# Altium schematic sheet Sitara_Sheet2.SchDoc
size A4; CompanyName: SPAN; Engineer: Anh Luong; Organization: University of Utah; Address1: 50 S Central Campus Dr; Address2: MEB Rm 3129; Address3: Salt Lake City, Utah 84115; Address4: USA; Revision: 1; SheetNumber: 1; SheetTotal: 1
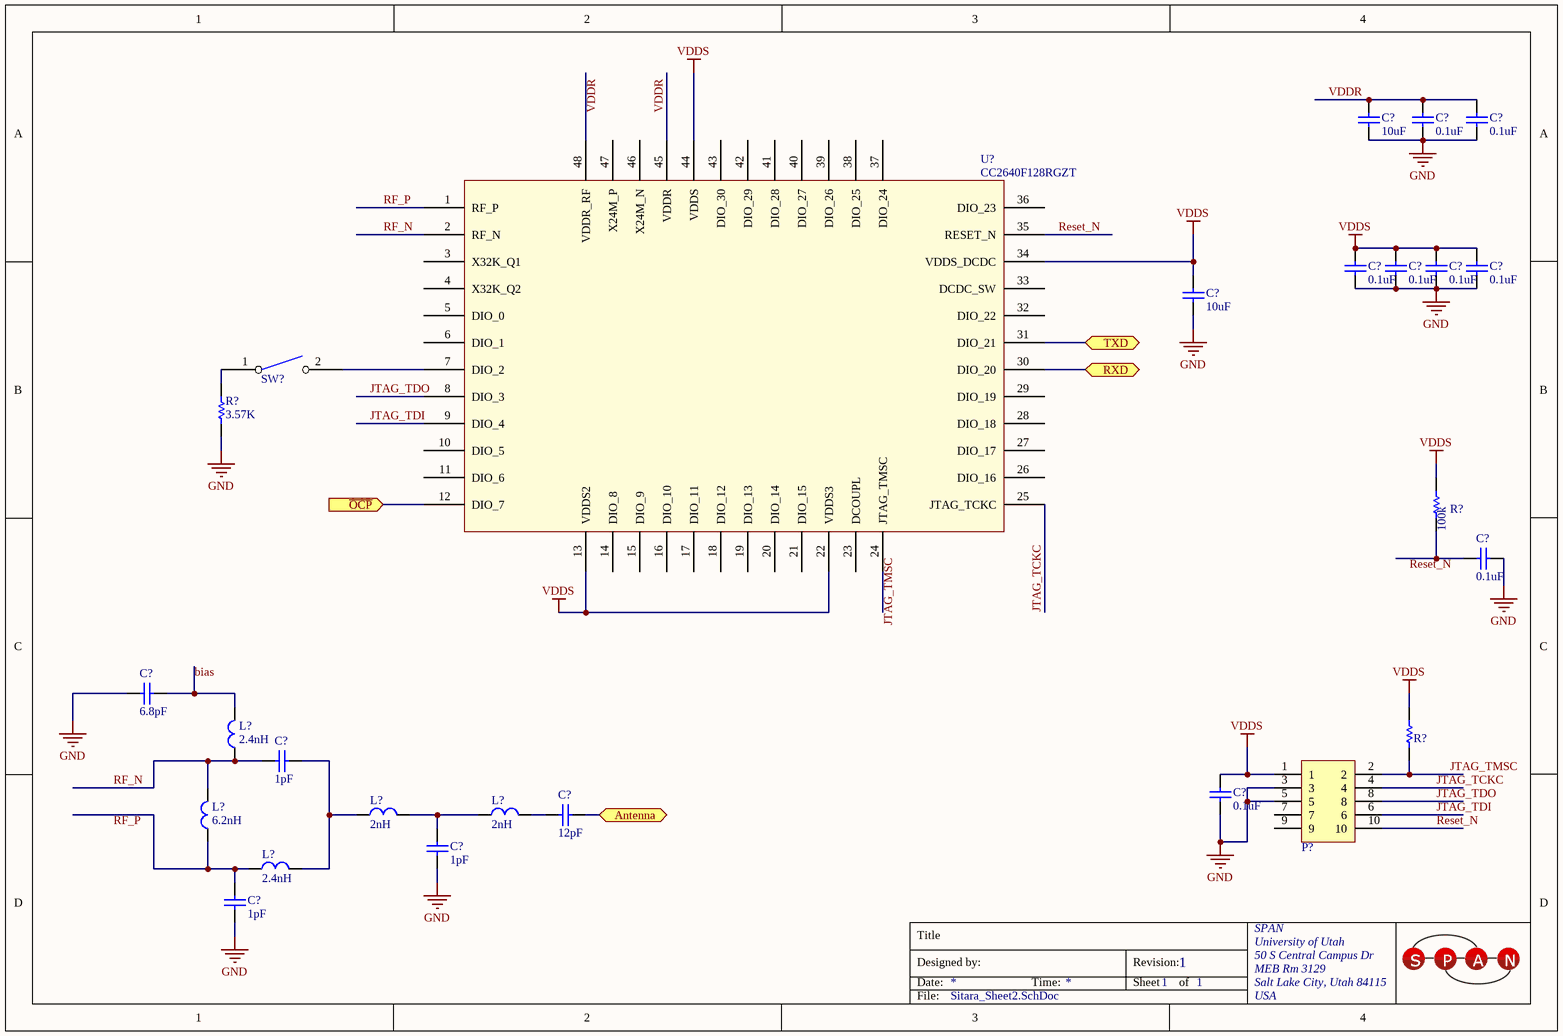
[diagram p0: Sitara_Sheet2.SchDoc]

## Parts
(Parts that share a designator on the sheet are numbered #1, #2 ... from top to bottom, then left to right.)
C?#1  10uF
C?#2  0.1uF
C?#3  0.1uF
C?#4  0.1uF
C?#5  0.1uF
C?#6  0.1uF
C?#7  0.1uF
C?#8  10uF
C?#9  0.1uF
C?#10  6.8pF
C?#11  1pF
C?#12  12pF
C?#13  0.1uF
C?#14  1pF
C?#15  1pF
L?#1  2.4nH
L?#2  2nH
L?#3  2nH
L?#4  6.2nH
L?#5  2.4nH
P?  M50-3500542  [M50]  (value not drawn)
R?#1  3.57K
R?#2  MCR03ERTJ104  [RESC1608X06N (0603)]  (value not drawn)
R?#3  10K  (value not drawn)
SW?  EVQ-PE105K  [EVQ-PE105K]  (value not drawn)
U?  CC2640F128RGZT

## Ports
Antenna (bidir), RXD, TXD, ~{OCP} (in)

## Nets
GND: C?#1.10 C?#2.8 C?#3.8 C?#4.8 C?#5.8 C?#6.8 C?#7.8 C?#8.10 C?#9.9 C?#10.0 C?#13.8 C?#14.2 C?#15.2 P?.3 P?.5 R?#1.16
VDDS: C?#4.9 C?#5.9 C?#6.9 C?#7.9 C?#8.11 C?#13.9 P?.1 R?#2.2 R?#3.1 U?.13(VDDS2) U?.22(VDDS3) U?.34(VDDS_DCDC) U?.44(VDDS)
Antenna: C?#12.5 ; port Antenna
bias: C?#10.1 L?#1.7
JTAG_TCKC: P?.4 U?.25(JTAG_TCKC)
JTAG_TDI: P?.6 U?.9(DIO_4)
JTAG_TDO: P?.8 U?.8(DIO_3)
JTAG_TMSC: P?.2 R?#3.0
~{OCP}: U?.12(DIO_7) ; port ~{OCP}
Reset_N: P?.10 U?.35(RESET_N)
RF_N: C?#11.2 L?#1.6 L?#4.11 U?.2(RF_N)
RF_P: U?.1(RF_P)
RXD: U?.30(DIO_20) ; port RXD
TXD: U?.31(DIO_21) ; port TXD
VDDR: C?#1.11 C?#2.9 C?#3.9 U?.45(VDDR)
NetC?#9_8: C?#9.8 R?#2.1
NetC?#11_3: C?#11.3 L?#2.8 L?#5.7
NetC?#12_4: C?#12.4 L?#3.9
NetC?#14_3: C?#14.3 L?#2.9 L?#3.8
NetC?#15_3: C?#15.3 L?#4.10 L?#5.6
NetR?#1_17: R?#1.17 SW?.1
NetSW?_2: SW?.2 U?.7(DIO_2)

Not connected (* = marked no-connect by the designer): P? 7 9; U? 3(X32K_Q1) 4(X32K_Q2) 5(DIO_0) 6(DIO_1) 10(DIO_5) 11(DIO_6) 14(DIO_8) 15(DIO_9) 16(DIO_10) 17(DIO_11) 18(DIO_12) 19(DIO_13) 20(DIO_14) 21(DIO_15) 23(DCOUPL) 24(JTAG_TMSC) 26(DIO_16) 27(DIO_17) 28(DIO_18) 29(DIO_19) 32(DIO_22) 33(DCDC_SW) 36(DIO_23) 37(DIO_24) 38(DIO_25) 39(DIO_26) 40(DIO_27) 41(DIO_28) 42(DIO_29) 43(DIO_30) 46(X24M_N) 47(X24M_P) 48(VDDR_RF)

## Notes on the sheet
- Labels drawn without touching a wire or pin: JTAG_TMSC, Reset_N, RF_P, VDDR
- Title
- Designed by:
- Date:
- Time:
- Revision:
- Sheet
- of
- File:

## Library data of the parts
C?#1 C?#8 = EMK107BC6106MA-T: CAP CER 10uF; Manufacturer: Taiyo Yuden; Capacitance: 10µF; Tolerance: ±20%; Voltage - Rated: 16V; Temperature Coefficient: X6S; Supplier 1: Digi-Key; Manufacturer Part Number: EMK107BC6106MA-T; RoHS: RoHS Compliant; Category: Capacitors; Stock 1: 0; Pricing 1: 4000=0.08689, 8000=0.08178, 12000=0.07922, 28000=0.07667, 100000=0.06798 (USD); Packaging: Tape & Reel (TR); Part Status: Active; Operating Temperature: -55°C ~ 105°C; Features: -; Ratings: -; Applications: SMPS Filtering; Failure Rate: -; Mounting Type: Surface Mount, MLCC; Package / Case: 0603 (1608 Metric); Size / Dimension: 0.063" L x 0.031" W (1.60mm x 0.80mm); Height - Seated (Max): -; Thickness (Max): 0.039" (1.00mm); Lead Spacing: -; Lead Style: -; ComponentLink1URL: http://www.yuden.co.jp/productdata/catalog/en/mlcc06_e.pdf; ComponentLink1Description: http://www.yuden.co.jp/productdata/catalog/en/mlcc06_e.pdf; Supplier Part Number 1: 587-4867-2-ND
C?#2-C?#7 C?#9 C?#13 = 0603YC104KAT4A: CAP CER 0.1UF 16V X7R 0603; Manufacturer: AVX Corporation; Capacitance: 0.1µF; Tolerance: ±10%; Supplier 1: Digi-Key; Manufacturer Part Number: 0603YC104KAT4A; RoHS: RoHS Compliant; Category: Capacitors; Stock 1: 15000; Pricing 1: 15000=0.00344, 30000=0.00327, 75000=0.00292, 105000=0.00237 (USD); Packaging: Tape & Reel (TR); Part Status: Active; Voltage - Rated: 16V; Temperature Coefficient: X7R; Operating Temperature: -55°C ~ 125°C; Features: -; Ratings: -; Applications: General Purpose; Failure Rate: -; Mounting Type: Surface Mount, MLCC; Package / Case: 0603 (1608 Metric); Size / Dimension: 0.063" L x 0.032" W (1.60mm x 0.81mm); Height - Seated (Max): -; Thickness (Max): 0.035" (0.90mm); Lead Spacing: -; Lead Style: -; ComponentLink1URL: http://datasheets.avx.com/X7RDielectric.pdf; ComponentLink1Description: http://datasheets.avx.com/X7RDielectric.pdf; Supplier Part Number 1: 478-10054-2-ND
C?#10 = CL10C6R8CB8NNNC: CAP CER 6.8PF 50V NP0 0603; Manufacturer: Samsung Electro-Mechanics America, Inc.; Tolerance: ±0.25pF; Temperature Coefficient: C0G, NP0; Supplier 1: Digi-Key; Manufacturer Part Number: CL10C6R8CB8NNNC; RoHS: RoHS Compliant; Category: Capacitors; Stock 1: 16000; Pricing 1: 4000=0.00876, 8000=0.008, 12000=0.00762, 28000=0.00724, 100000=0.00524 (USD); Packaging: Tape & Reel (TR); Part Status: Active; Capacitance: 6.8pF; Voltage - Rated: 50V; Operating Temperature: -55°C ~ 125°C; Features: -; Ratings: -; Applications: General Purpose; Mounting Type: Surface Mount, MLCC; Package / Case: 0603 (1608 Metric); Size / Dimension: 0.063" L x 0.031" W (1.60mm x 0.80mm); Height - Seated (Max): -; Thickness (Max): 0.035" (0.90mm); Lead Spacing: -; Lead Style: -; ComponentLink1URL: http://www.samsungsem.com/kr/support/product-search/mlcc/__icsFiles/afieldfile/2016/08/18/S_CL10C6R8CB8NNNC.pdf; ComponentLink1Description: http://www.samsungsem.com/kr/support/product-search/mlcc/__icsFiles/afieldfile/2016/08/18/S_CL10C6R8CB8NNNC.pdf; Supplier Part Number 1: 1276-1793-2-ND
C?#11 C?#14 C?#15 = 251R14S1R0BV4T: CAP CER 1PF 250V NP0 0603; Manufacturer: Johanson Technology Inc.; Tolerance: ±0.1pF; Temperature Coefficient: C0G, NP0; Supplier 1: Digi-Key; Manufacturer Part Number: 251R14S1R0BV4T; RoHS: RoHS Compliant; Category: Capacitors; Stock 1: 92000; Pricing 1: 4000=0.048, 8000=0.0456, 12000=0.0432, 28000=0.0408, 100000=0.0324 (USD); Packaging: Tape & Reel (TR); Part Status: Active; Capacitance: 1pF; Voltage - Rated: 250V; Operating Temperature: -55°C ~ 125°C; Features: High Q, Low Loss; Ratings: -; Applications: RF, Microwave, High Frequency; Mounting Type: Surface Mount, MLCC; Package / Case: 0603 (1608 Metric); Size / Dimension: 0.062" L x 0.032" W (1.57mm x 0.81mm); Height - Seated (Max): -; Thickness (Max): 0.035" (0.89mm); Lead Spacing: -; Lead Style: -; ComponentLink1URL: http://www.johansontechnology.com/downloads/JTI-CAT-MLCC-HighQ.pdf; ComponentLink1Description: http://www.johansontechnology.com/downloads/JTI-CAT-MLCC-HighQ.pdf; Supplier Part Number 1: 712-1323-2-ND
C?#12 = 251R14S120GV4T: CAP CER 12PF 250V NP0 0603; Manufacturer: Johanson Technology Inc.; Tolerance: ±2%; Temperature Coefficient: C0G, NP0; Supplier 1: Digi-Key; Manufacturer Part Number: 251R14S120GV4T; RoHS: RoHS Compliant; Category: Capacitors; Stock 1: 32000; Pricing 1: 4000=0.1071, 8000=0.1008, 12000=0.09765, 28000=0.0945, 100000=0.0819 (USD); Packaging: Tape & Reel (TR); Part Status: Active; Capacitance: 12pF; Voltage - Rated: 250V; Operating Temperature: -55°C ~ 125°C; Features: High Q, Low Loss; Ratings: -; Applications: RF, Microwave, High Frequency; Mounting Type: Surface Mount, MLCC; Package / Case: 0603 (1608 Metric); Size / Dimension: 0.062" L x 0.032" W (1.57mm x 0.81mm); Height - Seated (Max): -; Thickness (Max): 0.035" (0.89mm); Lead Spacing: -; Lead Style: -; ComponentLink1URL: http://www.johansontechnology.com/downloads/JTI-CAT-MLCC-HighQ.pdf; ComponentLink1Description: http://www.johansontechnology.com/downloads/JTI-CAT-MLCC-HighQ.pdf; Supplier Part Number 1: 712-1313-2-ND
L?#1 L?#5 = LQW18AN2N4C80D: FIXED IND 2.4NH 2.4A 26 MOHM SMD; Manufacturer: Murata Electronics North America; Type: Wirewound; Material - Core: Non-Magnetic; Tolerance: ±0.2nH; Shielding: Unshielded; DC Resistance (DCR): 26 mOhm Max; Q @ Freq: 18 @ 250MHz; Frequency - Self Resonant: 15GHz; Frequency - Test: 100MHz; Supplier 1: Digi-Key; Manufacturer Part Number: LQW18AN2N4C80D; RoHS: RoHS Compliant; Category: Inductors, Coils, Chokes; Stock 1: 0; Pricing 1: 4000=0.0729, 8000=0.06885, 12000=0.0648, 28000=0.06278, 100000=0.05873 (USD); Packaging: Tape & Reel (TR); Part Status: Active; Inductance: 2.4nH; Current Rating: 2.4A; Current - Saturation: -; Ratings: -; Operating Temperature: -55°C ~ 125°C; Mounting Type: Surface Mount; Package / Case: 0603 (1608 Metric); Supplier Device Package: 0603 (1608 Metric); Size / Dimension: 0.065" L x 0.035" W (1.65mm x 0.90mm); Height - Seated (Max): 0.039" (1.00mm); ComponentLink1URL: http://search.murata.co.jp/Ceramy/image/img/P02/JELF243A-0102.pdf; ComponentLink1Description: http://search.murata.co.jp/Ceramy/image/img/P02/JELF243A-0102.pdf; Supplier Part Number 1: 490-14721-2-ND
L?#2 L?#3 = L-14W2N0CV4E: FIXED IND 2NH 700MA 80 MOHM SMD; Manufacturer: Johanson Technology Inc.; Type: Wirewound; Material - Core: Ceramic; Tolerance: ±0.2nH; Shielding: Unshielded; DC Resistance (DCR): 80 mOhm Max; Q @ Freq: 16 @ 250MHz; Frequency - Self Resonant: 6.9GHz; Frequency - Test: 250MHz; Supplier 1: Digi-Key; Manufacturer Part Number: L-14W2N0CV4E; RoHS: RoHS Compliant; Category: Inductors, Coils, Chokes; Stock 1: 0; Pricing 1: 3000=0.0901, 6000=0.0848, 15000=0.08215, 30000=0.0795, 75000=0.07685 (USD); Packaging: Tape & Reel (TR); Part Status: Active; Inductance: 2nH; Current Rating: 700mA; Current - Saturation: -; Ratings: -; Operating Temperature: -40°C ~ 125°C; Mounting Type: Surface Mount; Package / Case: 0603 (1608 Metric); Supplier Device Package: 0603 (1608 Metric); Size / Dimension: 0.063" L x 0.031" W (1.60mm x 0.80mm); Height - Seated (Max): 0.037" (0.94mm); ComponentLink1URL: http://www.johansontechnology.com/downloads/jti-cat-ww-ind.pdf; ComponentLink1Description: http://www.johansontechnology.com/downloads/jti-cat-ww-ind.pdf; Supplier Part Number 1: 712-1618-2-ND
L?#4 = LQP15MN6N2B02D: FIXED IND 6.2NH 130MA 900 MOHM; Manufacturer: Murata Electronics North America; Type: Thin Film; Material - Core: Non-Magnetic; Tolerance: ±0.1nH; Shielding: Unshielded; DC Resistance (DCR): 900 mOhm Max; Q @ Freq: 13 @ 500MHz; Frequency - Self Resonant: 6GHz; Frequency - Test: 500MHz; Supplier 1: Digi-Key; Manufacturer Part Number: LQP15MN6N2B02D; RoHS: RoHS Compliant; Category: Inductors, Coils, Chokes; Stock 1: 20000; Pricing 1: 10000=0.05344, 30000=0.05177, 50000=0.0501, 100000=0.04843 (USD); Packaging: Tape & Reel (TR); Part Status: Active; Inductance: 6.2nH; Current Rating: 130mA; Current - Saturation: -; Ratings: -; Operating Temperature: -40°C ~ 85°C; Mounting Type: Surface Mount; Package / Case: 0402 (1005 Metric); Supplier Device Package: 0402 (1005 Metric); Size / Dimension: 0.039" L x 0.020" W (1.00mm x 0.50mm); Height - Seated (Max): 0.018" (0.45mm); ComponentLink1URL: http://search.murata.co.jp/Ceramy/image/img/PDF/ENG/L0075S0084LQP15M.pdf; ComponentLink1Description: http://search.murata.co.jp/Ceramy/image/img/PDF/ENG/L0075S0084LQP15M.pdf; Supplier Part Number 1: 490-6759-2-ND
P? = M50-3500542: CONN HDR 1.27MM VERT AU 10POS; Manufacturer: Harwin Inc; Connector Type: Unshrouded; Number of Positions: 10; Number of Positions Loaded: All; Pitch: 0.050" (1.27mm); Molding Height Above Board: 0.039" (1.00mm); Supplier 1: Digi-Key; Manufacturer Part Number: M50-3500542; RoHS: RoHS Compliant; Category: Connectors, Interconnects; Stock 1: 16006; Pricing 1: 1=1.16, 10=1.017, 25=0.9576, 50=0.9178, 100=0.8778, 250=0.798, 500=0.7182, 1000=0.6384, 2500=0.57855 (USD); Packaging: Bulk; Number of Rows: 2; Row Spacing: 0.050" (1.27mm); Height Stacking (Mating): -; Contact Mating Length: 0.118" (3.00mm); Mounting Type: Through Hole; Termination: Solder; Contact Finish: Gold; Contact Finish Thickness: 5.9µin (0.15µm); Features: -; Color: Black; ComponentLink1URL: http://harwin.com/includes/pdfs/M50-350.pdf; ComponentLink1Description: http://harwin.com/includes/pdfs/M50-350.pdf
R?#1 = TNPW06033K57BEEA: RES SMD 3.57KOHM 0.1% 1/10W 0603; Manufacturer: Vishay Dale; Power (Watts): 0.1W, 1/10W; Temperature Coefficient: ±25ppm/°C; Supplier 1: Digi-Key; Manufacturer Part Number: TNPW06033K57BEEA; RoHS: RoHS Compliant; Category: Resistors; Stock 1: 0; Pricing 1: 5000=0.1064 (USD); Packaging: Tape & Reel (TR); Part Status: Active; Resistance (Ohms): 3.57k; Tolerance: ±0.1%; Composition: Thin Film; Features: Anti-Sulfur, Automotive AEC-Q200, Moisture Resistant; Operating Temperature: -55°C ~ 125°C; Package / Case: 0603 (1608 Metric); Supplier Device Package: 0603; Size / Dimension: 0.063" L x 0.033" W (1.60mm x 0.85mm); Height - Seated (Max): 0.022" (0.55mm); Number of Terminations: 2; Failure Rate: -; ComponentLink1URL: http://www.vishay.com/docs/28758/tnpw_e3.pdf; ComponentLink1Description: http://www.vishay.com/docs/28758/tnpw_e3.pdf; Supplier Part Number 1: TNPW06033K57BEEA-ND
R?#2 = MCR03ERTJ104: RES 100K OHM 1/10W 5% 0603 SMD; Manufacturer: Rohm Semiconductor; Power (Watts): 0.1W, 1/10W; Temperature Coefficient: ±200ppm/°C; Supplier 1: Digi-Key; Manufacturer Part Number: MCR03ERTJ104; RoHS: RoHS Compliant; Category: Resistors; Stock 1: 70000; Pricing 1: 5000=0.00122, 10000=0.00106, 25000=0.00093, 50000=0.00085, 125000=0.00083 (USD); Packaging: Tape & Reel (TR); Resistance (Ohms): 100k; Tolerance: ±5%; Composition: Thick Film; Features: -; Operating Temperature: -55°C ~ 155°C; Package / Case: 0603 (1608 Metric); Supplier Device Package: 0603 (1608 Metric); Size / Dimension: 0.063" L x 0.031" W (1.60mm x 0.80mm); Height: 0.022" (0.55mm); Number of Terminations: 2; ComponentLink1URL: http://rohmfs.rohm.com/en/products/databook/datasheet/passive/resistor/chip_resistor/mcr_g.pdf; ComponentLink1Description: http://rohmfs.rohm.com/en/products/databook/datasheet/passive/resistor/chip_resistor/mcr_g.pdf
R?#3 = PHT0603Y1002BGT200: RES SMD 10KOHM 0.1% 0.0375W 0603; Manufacturer: Vishay Sfernice; Temperature Coefficient: ±15ppm/°C; Supplier 1: Digi-Key; Manufacturer Part Number: PHT0603Y1002BGT200; RoHS: RoHS Compliant; Category: Resistors; Stock 1: 400; Pricing 1: 200=6.6496, 400=6.0262, 600=5.6106, 1000=5.195 (USD); Packaging: Tape & Reel (TR); Part Status: Active; Resistance (Ohms): 10k; Tolerance: ±0.1%; Power (Watts): 0.0375W; Composition: Thin Film; Features: Anti-Sulfur; Operating Temperature: -55°C ~ 215°C; Package / Case: 0603 (1608 Metric); Supplier Device Package: 0603; Size / Dimension: 0.060" L x 0.033" W (1.52mm x 0.85mm); Height - Seated (Max): 0.025" (0.64mm); Number of Terminations: 2; Failure Rate: -; ComponentLink1URL: http://www.vishay.com/docs/53050/pht.pdf; ComponentLink1Description: http://www.vishay.com/docs/53050/pht.pdf; Supplier Part Number 1: PHTB-10KTR-ND
SW? = EVQ-PE105K: SWITCH TACTILE SPST-NO 0.05A 12V; Manufacturer: Panasonic Electronic Components; Switch Function: Off-Mom; Contact Rating @ Voltage: 0.05A @ 12VDC; Actuator Type: Standard; Actuator Height off PCB, from Pins: 5.00mm; Actuator Orientation: Top Actuated; Outline: 6.00mm x 3.50mm; Illumination: Non-Illuminated; Operating Force: 100gf; Switch Travel: 0.25mm; Mechanical Life: 50,000 Cycles; Supplier 1: Digi-Key; Manufacturer Part Number: EVQ-PE105K; RoHS: RoHS Compliant; Category: Switches; Stock 1: 18000; Pricing 1: 2000=0.32832, 4000=0.3078, 6000=0.29754, 10000=0.27702, 14000=0.27292, 50000=0.26676 (USD); Packaging: Tape & Reel (TR); Circuit: SPST-NO; Mounting Type: Surface Mount; Termination Style: Gull Wing; Illumination Voltage (Nominal): -; Illumination Type, Color: -; Ingress Protection: -; Features: -; Actuator Material: -; Operating Temperature: -30°C ~ 85°C; ComponentLink1URL: http://www.panasonic.com/industrial/components/pdf/ATK0000CE7.pdf; ComponentLink1Description: http://www.panasonic.com/industrial/components/pdf/ATK0000CE7.pdf
U? = CC2640F128RGZT: IC RF TXRX+MCU BLUETOOTH 48VFQFN; Manufacturer: Texas Instruments; Protocol: Bluetooth v4.1; Modulation: DSSS, O-QPSK, GFSK; Frequency: 2.4GHz; Data Rate (Max): 1Mbps; Power - Output: 5dBm; Sensitivity: -97dBm; Memory Size: 128kB Flash, 28kB SRAM; Serial Interfaces: I²C, I²S, JTAG, SPI, UART; GPIO: 31; Voltage - Supply: 1.8 V ~ 3.8 V; Current - Receiving: 5.9mA ~ 6.1mA; Current - Transmitting: 6.1mA ~ 9.1mA; Supplier 1: Digi-Key; RoHS: RoHS Compliant; Category: RF/IF and RFID; Stock 1: 5250; Pricing 1: 250=3.99416, 500=3.58394, 750=3.23851, 1250=3.0226 (USD); Packaging: Tape & Reel (TR); Part Status: Active; Type: TxRx + MCU; RF Family/Standard: Bluetooth; Operating Temperature: -40°C ~ 85°C; Package / Case: 48-VFQFN Exposed Pad; ComponentLink1URL: http://www.ti.com/lit/ds/symlink/cc2640.pdf; ComponentLink1Description: http://www.ti.com/lit/ds/symlink/cc2640.pdf; Supplier Part Number 1: 296-39655-2-ND; Manufacturer Part Number: CC2640F128RGZT